# Altium schematic sheet KT430A.SchDoc
size A4
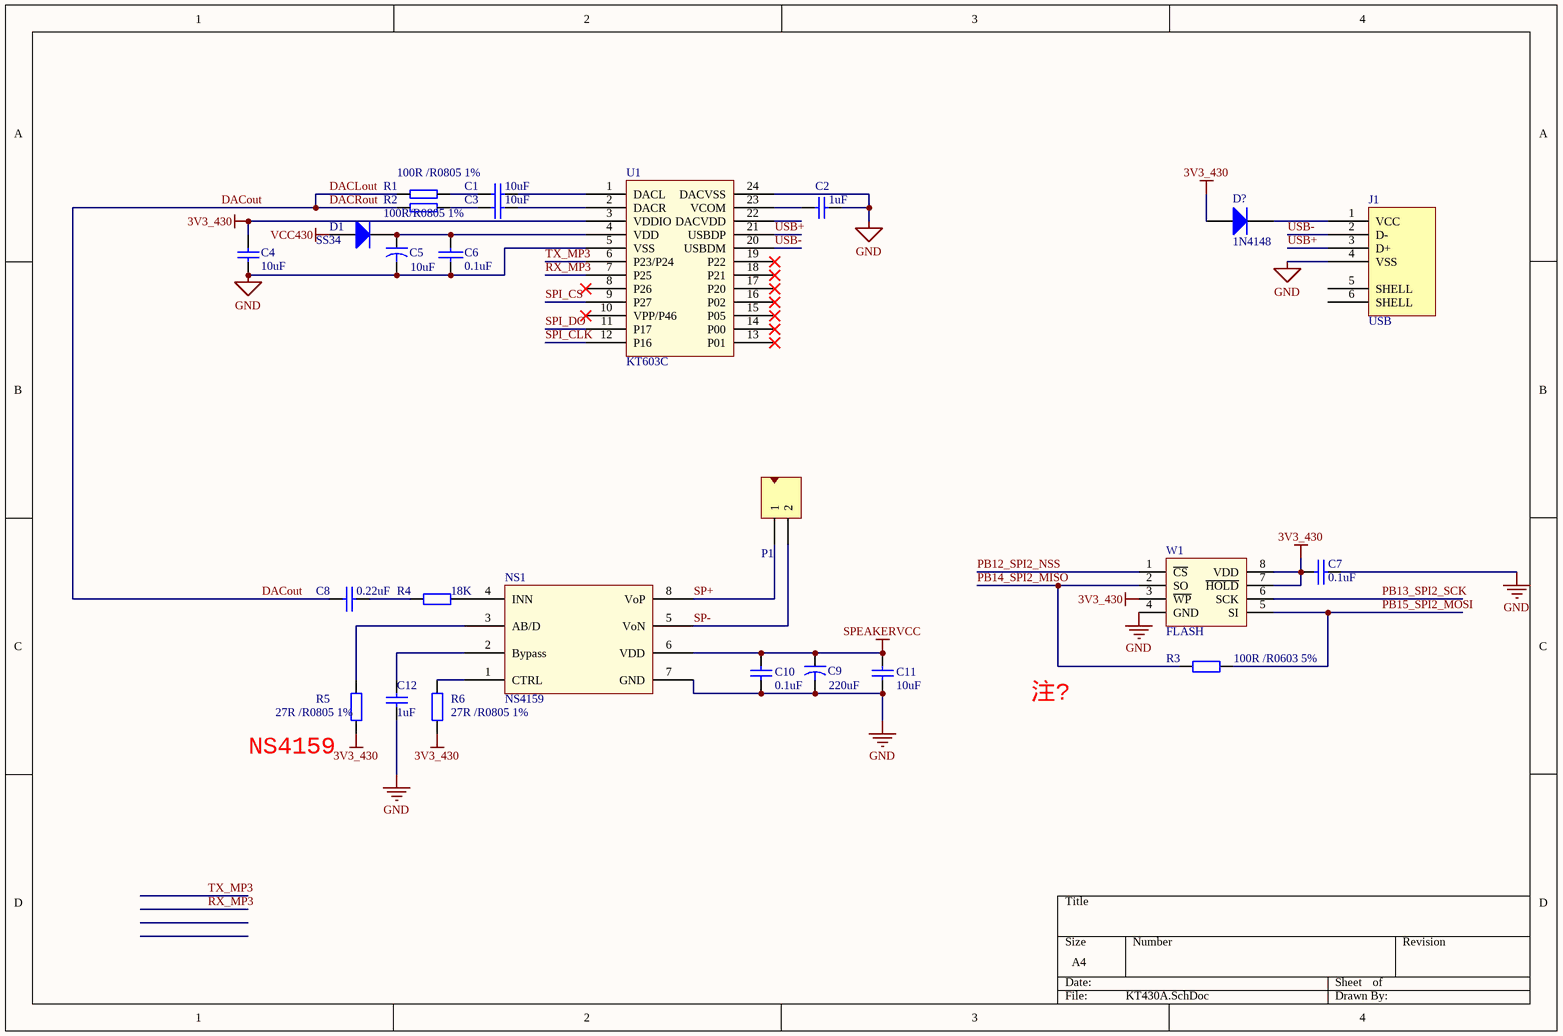
[diagram p0: KT430A.SchDoc]

## Parts
C1  10uF  [0805-1]
C2  1uF  [0805-1]
C3  10uF  [0805-1]
C4  10uF  [0805-1]
C5  10uF  [0805-1]
C6  0.1uF  [0603-1]
C7  0.1uF  [0603-1]
C8  0.22uF  [0805-1]
C9  value 220uF  [HONOR_63X54]  (hidden comment: 220uF/16V)
C10  0.1uF  [0603-1]
C11  10uF  [0805-1]
C12  1uF  [0805-1]
D1  SS34  [LC-SMA(DO-214AC)_S5]
D?  1N4148  [D-1206]
J1  USB  [USB_MICRO]
NS1  NS4159  [LC-SOP-8_EP_150mil]
P1  Header 2  [KF2.54-2P]  (value not drawn)
R1  100R /R0805 1%  [0805-1]
R2  100R/R0805 1%  [0805-1]
R3  100R /R0603 5%  [0603-1]
R4  18K  [0805-1]
R5  27R /R0805 1%  [0805-1]
R6  27R /R0805 1%  [0805-1]
U1  KT603C  [SSOP24]
W1  FLASH  [SOIC8]

## Nets
3V3_430: C4.2 C7.1 D?.1(A) R5.2 R6.2 U1.3(VDDIO) W1.3(~{WP}) W1.7(~{HOLD}) W1.8(VDD)
GND: C2.2 C4.1 C5.2 C6.1 C7.2 C9.2 C10.2 C11.2 C12.2 J1.4(VSS) NS1.7(GND) U1.5(VSS) U1.24(DACVSS) W1.4(GND)
SPEAKERVCC: C9.1 C10.1 C11.1 NS1.6(VDD)
VCC430: D1.1(A)
DACLout: C8.1 R1.2 R2.2  [also labelled DACout, DACRout]
PB12_SPI2_NSS: W1.1(~{CS})
PB13_SPI2_SCK: W1.6(SCK)
PB14_SPI2_MISO: R3.1 W1.2(SO)
PB15_SPI2_MOSI: R3.2 W1.5(SI)
RX_MP3: U1.7(P25)
SP+: NS1.8(VoP) P1.1
SP-: NS1.5(VoN) P1.2
SPI_CLK: U1.12(P16)
SPI_CS: U1.9(P27)
SPI_DO: U1.11(P17)
TX_MP3: U1.6(P23/P24)
USB+: J1.3(D+) U1.21(USBDP)
USB-: J1.2(D-) U1.20(USBDM)
NetC1_1: C1.1 R1.1
NetC1_2: C1.2 U1.1(DACL)
NetC2_1: C2.1 U1.23(VCOM)
NetC3_1: C3.1 R2.1
NetC3_2: C3.2 U1.2(DACR)
NetC5_1: C5.1 C6.2 D1.2(K) U1.4(VDD)
NetC8_2: C8.2 R4.2
NetC12_1: C12.1 NS1.2(Bypass)
NetD?_2: D?.2(K) J1.1(VCC)
NetNS1_1: NS1.1(CTRL) R6.1
NetNS1_3: NS1.3(AB/D) R5.1
NetNS1_4: NS1.4(INN) R4.1

Not connected (* = marked no-connect by the designer): J1 5(SHELL) 6(SHELL); U1 8(P26)* 10(VPP/P46)* 13(P01)* 14(P00)* 15(P05)* 16(P02)* 17(P20)* 18(P21)* 19(P22)* 22(DACVDD)

## Notes on the sheet
- 注?
- (near R5) NS4159

## Library data of the parts
C1-C4 C10-C12 = Cap: Capacitor; Published: 8-Jun-2000; Revision: July-2002: Re-released for DXP Platform.; Publisher: Altium Limited
  C1 C3 C4 C11: Value: 10uF
  C2 C12: Value: 1uF
  C10: Value: 0.1uF
C5 C9 = Cap2: Capacitor; Published: 23-Sep-2002; PackageReference: CAPR5-4X5; Publisher: Altium Limited
  C5: Value: 10uF
C6 C8 = C
C7 = CAP
D1 = Diode: Default Diode; Published: 8-Jun-2000; LatestRevisionDate: 17-Jul-2002; LatestRevisionNote: Re-released for DXP Platform.; PackageDocument: Sep-1996; PackageReference: SMC; Publisher: Altium Limited; Code_JEDEC: DO-214-AB
D? = Diode: 二极管; Published: 8-Jun-2000; LatestRevisionDate: 17-Jul-2002; LatestRevisionNote: Re-released for DXP Platform.; PackageDocument: Sep-1996; PackageReference: SMC; Publisher: Altium Limited; Code_JEDEC: DO-214-AB
J1 = USB: USB接口
NS1 = NS4159: 音频放大器
P1 = Header 2: 接插件; LatestRevisionDate: 17-Jul-2002; LatestRevisionNote: Re-released for DXP Platform.; Publisher: Altium Limited
R1 R2 = RES2
R3 = Res2: Resistor; Value: 1K; Published: 8-Jun-2000; LatestRevisionDate: 17-Jul-2002; LatestRevisionNote: Re-released for DXP Platform.; PackageReference: AXIAL-0.4; Publisher: Altium Limited
R4-R6 = Res2: Resistor; Published: 8-Jun-2000; LatestRevisionDate: 17-Jul-2002; LatestRevisionNote: Re-released for DXP Platform.; PackageReference: AXIAL-0.4; Publisher: Altium Limited
  R4: Value: 18K
  R5 R6: Value: 27R
U1 = AC24-TTS
W1 = SPI FLASH